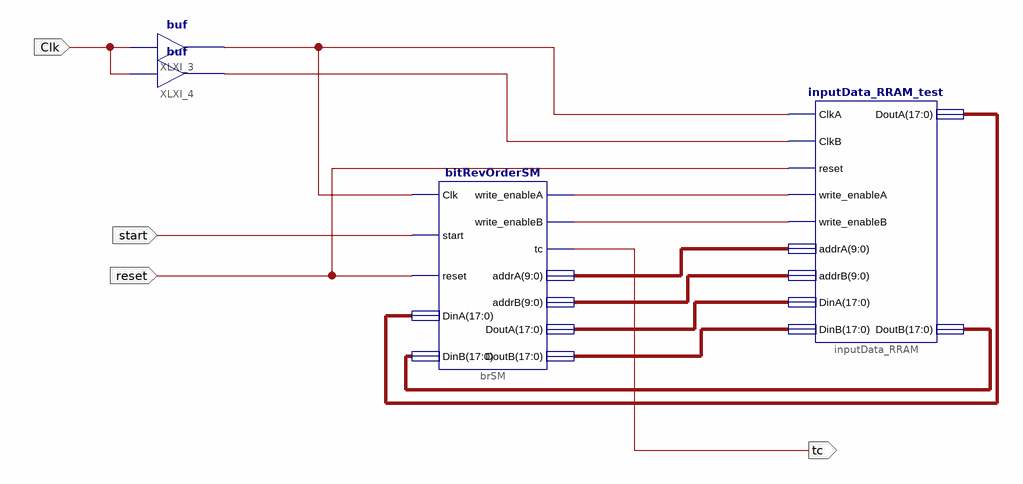
[diagram p0: schematic sheet 1]
// Xilinx ISE schematic bitRevOrder_SM_Top.sch (spartan6) as structural Verilog: 4 symbols, 4 ports
module bitRevOrder_SM_Top (
  input  start,
  input  reset,
  input  Clk,
  output tc
);

  wire XLXN_1, XLXN_2, XLXN_8, XLXN_9;
  wire [9:0] XLXN_3, XLXN_4;
  wire [17:0] XLXN_5, XLXN_6, XLXN_18, XLXN_19;

  bitRevOrderSM brSM (
    .Clk(XLXN_8), .start(start), .reset(reset), .DinA(XLXN_18), .DinB(XLXN_19), .write_enableA(XLXN_1),
    .write_enableB(XLXN_2), .tc(tc), .addrA(XLXN_3), .addrB(XLXN_4), .DoutA(XLXN_5), .DoutB(XLXN_6));
  inputData_RRAM_test inputData_RRAM (
    .ClkA(XLXN_8), .ClkB(XLXN_9), .reset(reset), .write_enableA(XLXN_1), .write_enableB(XLXN_2),
    .addrA(XLXN_3), .addrB(XLXN_4), .DinA(XLXN_5), .DinB(XLXN_6), .DoutA(XLXN_18), .DoutB(XLXN_19));
  buf XLXI_3 (XLXN_8, Clk);
  buf XLXI_4 (XLXN_9, Clk);
endmodule
